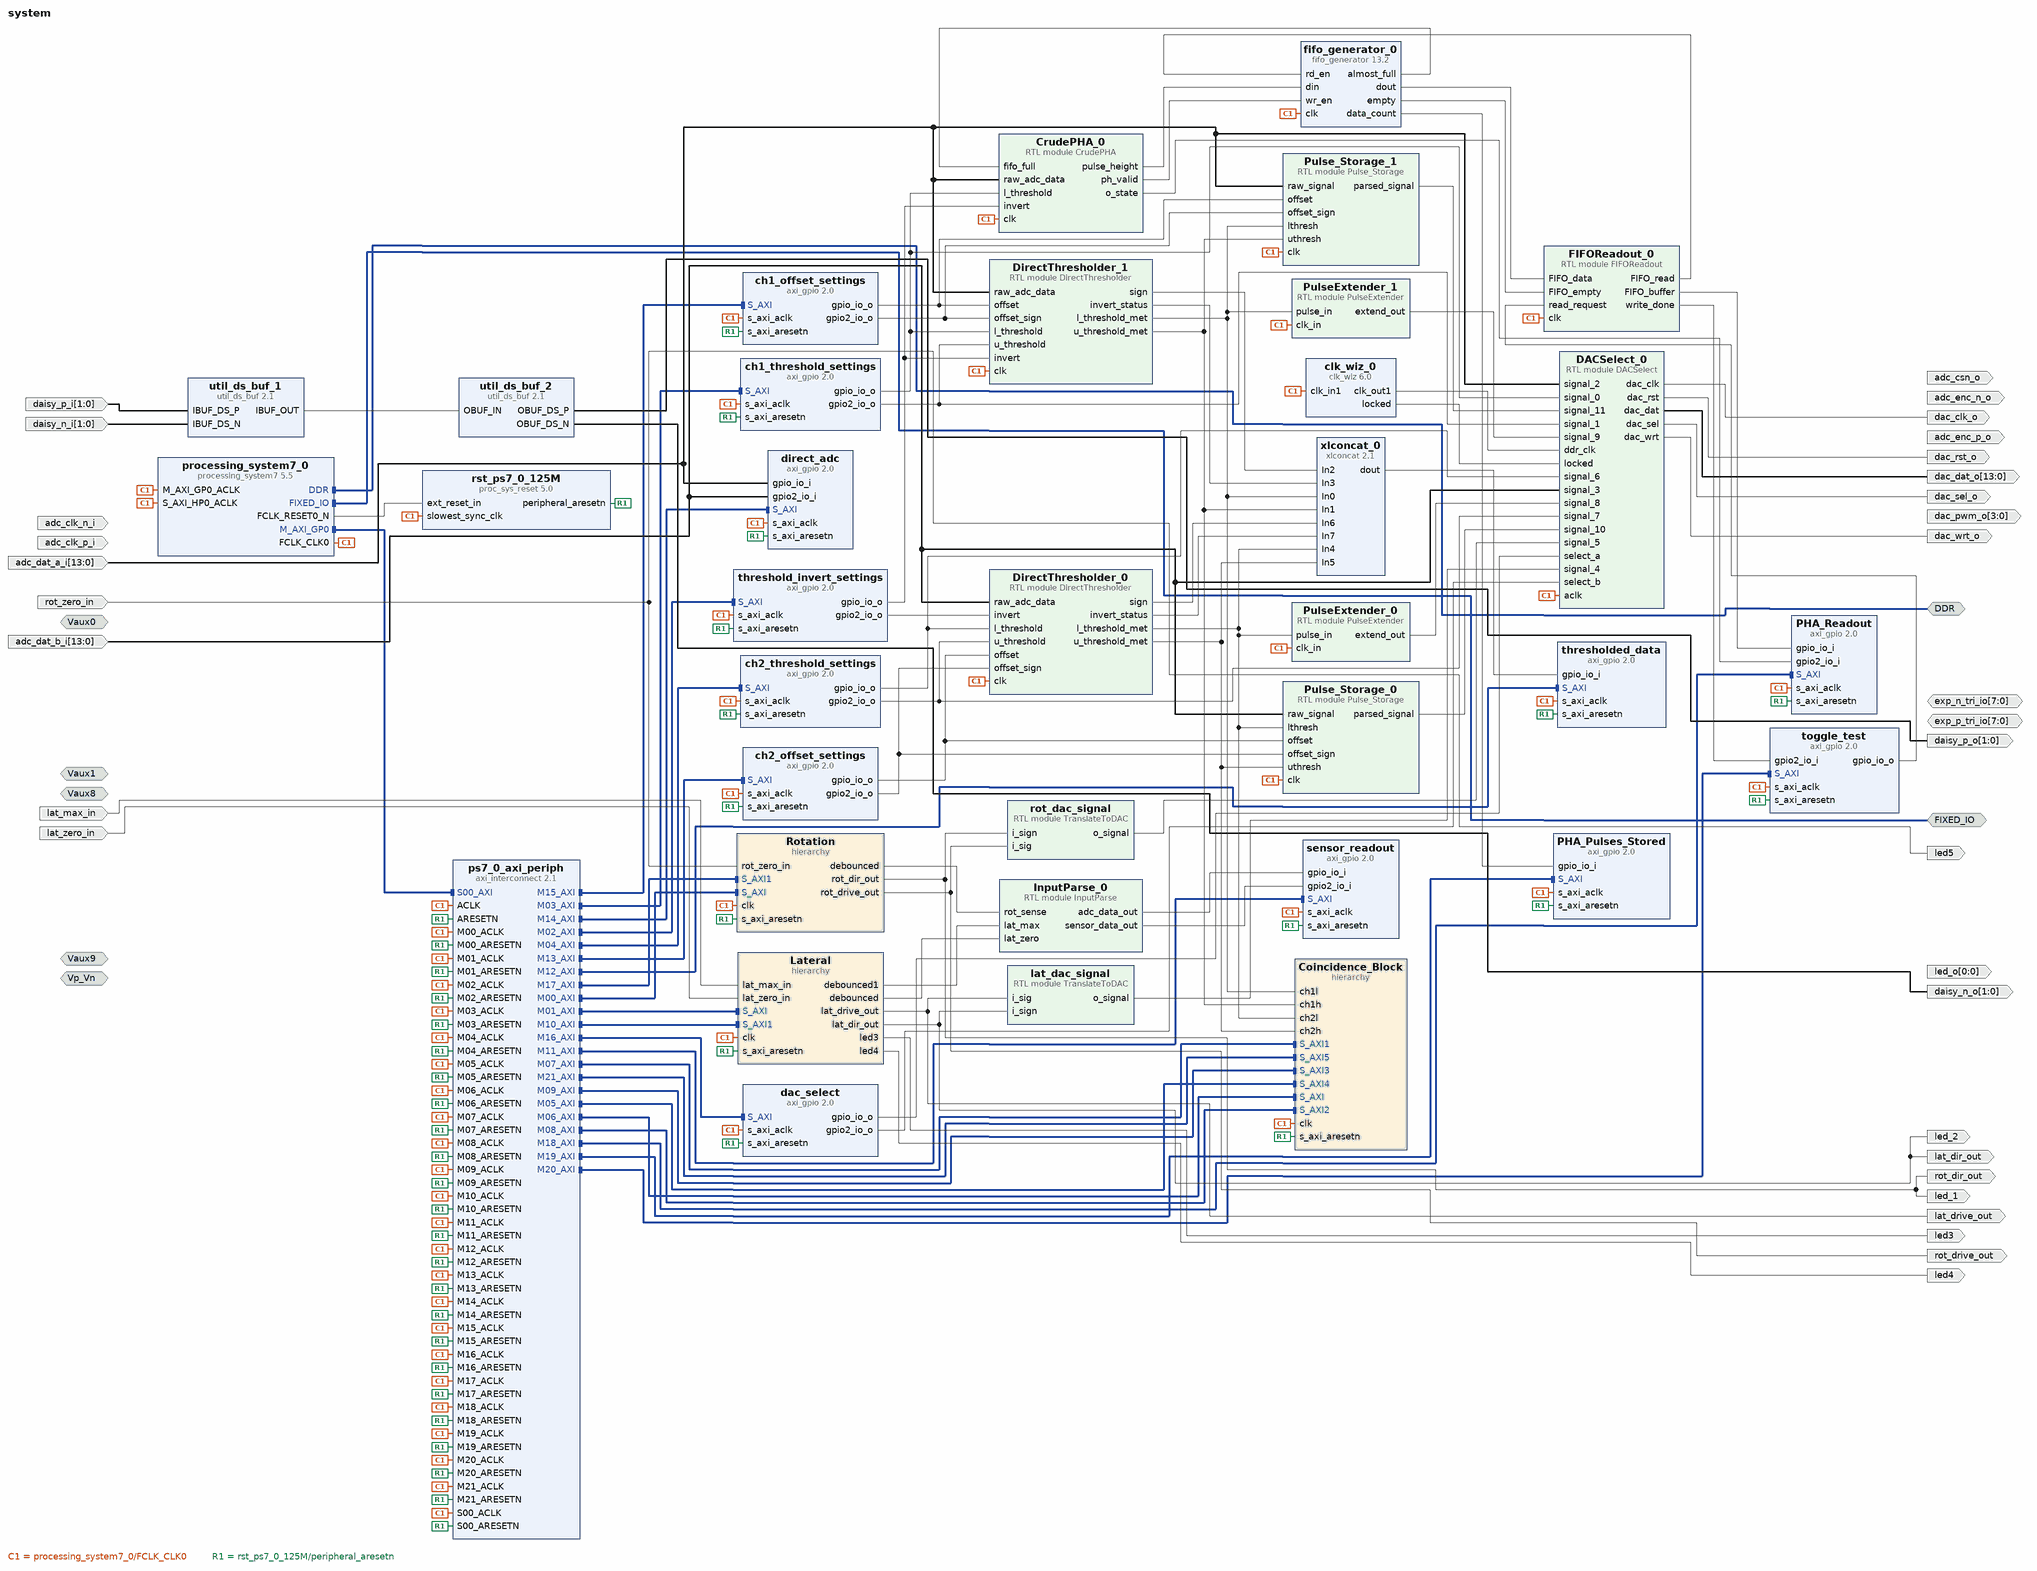
[diagram p0: block diagram of the top level]
# Vivado block design system, xc7z010clg400-1, Vivado 2020.1
create_bd_design system

create_bd_intf_port -mode Slave -vlnv xilinx.com:interface:diff_analog_io_rtl:1.0 Vp_Vn
create_bd_intf_port -mode Slave -vlnv xilinx.com:interface:diff_analog_io_rtl:1.0 Vaux0
create_bd_intf_port -mode Slave -vlnv xilinx.com:interface:diff_analog_io_rtl:1.0 Vaux1
create_bd_intf_port -mode Slave -vlnv xilinx.com:interface:diff_analog_io_rtl:1.0 Vaux9
create_bd_intf_port -mode Slave -vlnv xilinx.com:interface:diff_analog_io_rtl:1.0 Vaux8
create_bd_intf_port -mode Master -vlnv xilinx.com:interface:ddrx_rtl:1.0 DDR
create_bd_intf_port -mode Master -vlnv xilinx.com:display_processing_system7:fixedio_rtl:1.0 FIXED_IO
create_bd_port -dir I -from 13 -to 0 adc_dat_a_i
create_bd_port -dir I -from 13 -to 0 adc_dat_b_i
create_bd_port -dir I adc_clk_p_i
create_bd_port -dir I adc_clk_n_i
create_bd_port -dir O adc_enc_p_o
create_bd_port -dir O adc_enc_n_o
create_bd_port -dir O adc_csn_o
create_bd_port -dir O -from 13 -to 0 dac_dat_o
create_bd_port -dir O dac_clk_o
create_bd_port -dir O dac_rst_o
create_bd_port -dir O dac_sel_o
create_bd_port -dir O dac_wrt_o
create_bd_port -dir O -from 3 -to 0 dac_pwm_o
create_bd_port -dir IO -from 7 -to 0 exp_p_tri_io
create_bd_port -dir IO -from 7 -to 0 exp_n_tri_io
create_bd_port -dir O -from 1 -to 0 daisy_p_o
create_bd_port -dir O -from 1 -to 0 daisy_n_o
create_bd_port -dir I -from 1 -to 0 daisy_p_i
create_bd_port -dir I -from 1 -to 0 daisy_n_i
create_bd_port -dir O -from 0 -to 0 led_o
create_bd_port -dir I rot_zero_in
create_bd_port -dir I lat_zero_in
create_bd_port -dir I lat_max_in
create_bd_port -dir O rot_drive_out
create_bd_port -dir O rot_dir_out
create_bd_port -dir O lat_drive_out
create_bd_port -dir O lat_dir_out
create_bd_port -dir O led_1
create_bd_port -dir O led_2
create_bd_port -dir O led3
create_bd_port -dir O led4
create_bd_port -dir O led5

create_bd_cell -type ip -vlnv xilinx.com:ip:processing_system7:5.5 processing_system7_0
set_property -dict [list \
  CONFIG.PCW_APU_PERIPHERAL_FREQMHZ 666.666666 \
  CONFIG.PCW_ENET0_ENET0_IO {MIO 16 .. 27} \
  CONFIG.PCW_ENET0_GRP_MDIO_ENABLE 1 \
  CONFIG.PCW_ENET0_GRP_MDIO_IO EMIO \
  CONFIG.PCW_ENET0_PERIPHERAL_ENABLE 1 \
  CONFIG.PCW_ENET0_RESET_ENABLE 0 \
  CONFIG.PCW_ENET_RESET_ENABLE 1 \
  CONFIG.PCW_ENET_RESET_SELECT {Share reset pin} \
  CONFIG.PCW_FPGA0_PERIPHERAL_FREQMHZ 125 \
  CONFIG.PCW_FPGA1_PERIPHERAL_FREQMHZ 250 \
  CONFIG.PCW_FPGA3_PERIPHERAL_FREQMHZ 200 \
  CONFIG.PCW_GPIO_MIO_GPIO_ENABLE 1 \
  CONFIG.PCW_GPIO_MIO_GPIO_IO MIO \
  CONFIG.PCW_GPIO_PERIPHERAL_ENABLE 1 \
  CONFIG.PCW_I2C0_GRP_INT_ENABLE 0 \
  CONFIG.PCW_I2C0_I2C0_IO {MIO 50 .. 51} \
  CONFIG.PCW_I2C0_PERIPHERAL_ENABLE 1 \
  CONFIG.PCW_I2C_PERIPHERAL_FREQMHZ 111.111115 \
  CONFIG.PCW_I2C_RESET_ENABLE 1 \
  CONFIG.PCW_I2C_RESET_SELECT {Share reset pin} \
  CONFIG.PCW_IMPORT_BOARD_PRESET cfg/red_pitaya.xml \
  CONFIG.PCW_PRESET_BANK1_VOLTAGE {LVCMOS 2.5V} \
  CONFIG.PCW_QSPI_GRP_SINGLE_SS_ENABLE 1 \
  CONFIG.PCW_QSPI_GRP_SINGLE_SS_IO {MIO 1 .. 6} \
  CONFIG.PCW_QSPI_PERIPHERAL_ENABLE 1 \
  CONFIG.PCW_QSPI_PERIPHERAL_FREQMHZ 125 \
  CONFIG.PCW_QSPI_QSPI_IO {MIO 1 .. 6} \
  CONFIG.PCW_SD0_GRP_CD_ENABLE 1 \
  CONFIG.PCW_SD0_GRP_CD_IO {MIO 46} \
  CONFIG.PCW_SD0_GRP_WP_ENABLE 1 \
  CONFIG.PCW_SD0_GRP_WP_IO {MIO 47} \
  CONFIG.PCW_SD0_PERIPHERAL_ENABLE 1 \
  CONFIG.PCW_SD0_SD0_IO {MIO 40 .. 45} \
  CONFIG.PCW_SDIO_PERIPHERAL_FREQMHZ 100 \
  CONFIG.PCW_SINGLE_QSPI_DATA_MODE x4 \
  CONFIG.PCW_SPI0_PERIPHERAL_ENABLE 1 \
  CONFIG.PCW_SPI0_SPI0_IO EMIO \
  CONFIG.PCW_SPI1_PERIPHERAL_ENABLE 1 \
  CONFIG.PCW_SPI1_SPI1_IO {MIO 10 .. 15} \
  CONFIG.PCW_TTC0_PERIPHERAL_ENABLE 1 \
  CONFIG.PCW_TTC0_TTC0_IO EMIO \
  CONFIG.PCW_UART0_PERIPHERAL_ENABLE 1 \
  CONFIG.PCW_UART0_UART0_IO {MIO 14 .. 15} \
  CONFIG.PCW_UART1_PERIPHERAL_ENABLE 1 \
  CONFIG.PCW_UART1_UART1_IO {MIO 8 .. 9} \
  CONFIG.PCW_UART_PERIPHERAL_FREQMHZ 100 \
  CONFIG.PCW_UIPARAM_DDR_BUS_WIDTH {16 Bit} \
  CONFIG.PCW_UIPARAM_DDR_FREQ_MHZ 533.333333 \
  CONFIG.PCW_UIPARAM_DDR_PARTNO {MT41J256M16 RE-125} \
  CONFIG.PCW_USB0_PERIPHERAL_ENABLE 1 \
  CONFIG.PCW_USB0_RESET_ENABLE 1 \
  CONFIG.PCW_USB0_RESET_IO {MIO 48} \
  CONFIG.PCW_USB0_USB0_IO {MIO 28 .. 39} \
  CONFIG.PCW_USB_RESET_ENABLE 1 \
  CONFIG.PCW_USB_RESET_SELECT {Share reset pin} \
  CONFIG.PCW_USE_S_AXI_HP0 1 \
] [get_bd_cells processing_system7_0]
# 429 more settings of processing_system7_0 are not shown: defaults, MIO pin electricals, DDR timing, and values the tool derives
create_bd_cell -type ip -vlnv xilinx.com:ip:util_ds_buf:2.1 util_ds_buf_1
set_property -dict {CONFIG.C_SIZE 2} [get_bd_cells util_ds_buf_1]
create_bd_cell -type ip -vlnv xilinx.com:ip:util_ds_buf:2.1 util_ds_buf_2
set_property -dict {CONFIG.C_BUF_TYPE OBUFDS CONFIG.C_SIZE 2} [get_bd_cells util_ds_buf_2]
create_bd_cell -type ip -vlnv xilinx.com:ip:proc_sys_reset:5.0 rst_ps7_0_125M
create_bd_cell -type hier Rotation
create_bd_cell -type ip -vlnv xilinx.com:ip:axi_interconnect:2.1 ps7_0_axi_periph
set_property -dict {CONFIG.NUM_MI 22} [get_bd_cells ps7_0_axi_periph]
create_bd_cell -type hier Lateral
create_bd_cell -type ip -vlnv xilinx.com:ip:clk_wiz:6.0 clk_wiz_0
set_property -dict [list \
  CONFIG.CLKIN1_JITTER_PS 80.0 \
  CONFIG.CLKOUT1_JITTER 104.759 \
  CONFIG.CLKOUT1_PHASE_ERROR 96.948 \
  CONFIG.CLKOUT1_REQUESTED_OUT_FREQ 250 \
  CONFIG.MMCM_CLKFBOUT_MULT_F 8.000 \
  CONFIG.MMCM_CLKIN1_PERIOD 8.000 \
  CONFIG.MMCM_CLKOUT0_DIVIDE_F 4.000 \
  CONFIG.PRIM_IN_FREQ 125 \
  CONFIG.USE_RESET false \
] [get_bd_cells clk_wiz_0]
create_bd_cell -type ip -vlnv xilinx.com:ip:axi_gpio:2.0 ch1_threshold_settings
set_property -dict [list \
  CONFIG.C_ALL_OUTPUTS 1 \
  CONFIG.C_ALL_OUTPUTS_2 1 \
  CONFIG.C_DOUT_DEFAULT 0x000000FA \
  CONFIG.C_DOUT_DEFAULT_2 0x000004F4 \
  CONFIG.C_IS_DUAL 1 \
] [get_bd_cells ch1_threshold_settings]
create_bd_cell -type ip -vlnv xilinx.com:ip:axi_gpio:2.0 ch2_threshold_settings
set_property -dict [list \
  CONFIG.C_ALL_OUTPUTS 1 \
  CONFIG.C_ALL_OUTPUTS_2 1 \
  CONFIG.C_DOUT_DEFAULT 0x000000FA \
  CONFIG.C_DOUT_DEFAULT_2 0x000004F4 \
  CONFIG.C_IS_DUAL 1 \
] [get_bd_cells ch2_threshold_settings]
create_bd_cell -type ip -vlnv xilinx.com:ip:axi_gpio:2.0 threshold_invert_settings
set_property -dict [list \
  CONFIG.C_ALL_OUTPUTS 1 \
  CONFIG.C_ALL_OUTPUTS_2 1 \
  CONFIG.C_DOUT_DEFAULT 0x00000000 \
  CONFIG.C_DOUT_DEFAULT_2 0x00000000 \
  CONFIG.C_GPIO2_WIDTH 1 \
  CONFIG.C_GPIO_WIDTH 1 \
  CONFIG.C_IS_DUAL 1 \
] [get_bd_cells threshold_invert_settings]
create_bd_cell -type ip -vlnv xilinx.com:ip:axi_gpio:2.0 sensor_readout
set_property -dict {CONFIG.C_ALL_INPUTS 1 CONFIG.C_ALL_INPUTS_2 1 CONFIG.C_IS_DUAL 1} [get_bd_cells sensor_readout]
create_bd_cell -type ip -vlnv xilinx.com:ip:xlconcat:2.1 xlconcat_0
set_property -dict {CONFIG.NUM_PORTS 8} [get_bd_cells xlconcat_0]
create_bd_cell -type ip -vlnv xilinx.com:ip:axi_gpio:2.0 thresholded_data
create_bd_cell -type module -reference InputParse InputParse_0
create_bd_cell -type ip -vlnv xilinx.com:ip:axi_gpio:2.0 direct_adc
set_property -dict {CONFIG.C_IS_DUAL 1} [get_bd_cells direct_adc]
create_bd_cell -type ip -vlnv xilinx.com:ip:axi_gpio:2.0 ch1_offset_settings
set_property -dict {CONFIG.C_IS_DUAL 1} [get_bd_cells ch1_offset_settings]
create_bd_cell -type ip -vlnv xilinx.com:ip:axi_gpio:2.0 ch2_offset_settings
set_property -dict {CONFIG.C_IS_DUAL 1} [get_bd_cells ch2_offset_settings]
create_bd_cell -type hier Coincidence_Block
create_bd_cell -type ip -vlnv xilinx.com:ip:axi_gpio:2.0 dac_select
set_property -dict [list \
  CONFIG.C_ALL_OUTPUTS 1 \
  CONFIG.C_ALL_OUTPUTS_2 1 \
  CONFIG.C_DOUT_DEFAULT_2 0x00000002 \
  CONFIG.C_GPIO2_WIDTH 8 \
  CONFIG.C_GPIO_WIDTH 8 \
  CONFIG.C_IS_DUAL 1 \
] [get_bd_cells dac_select]
create_bd_cell -type module -reference TranslateToDAC lat_dac_signal
create_bd_cell -type module -reference TranslateToDAC rot_dac_signal
create_bd_cell -type ip -vlnv xilinx.com:ip:fifo_generator:13.2 fifo_generator_0
set_property -dict [list \
  CONFIG.Almost_Full_Flag true \
  CONFIG.Data_Count true \
  CONFIG.Input_Data_Width 32 \
  CONFIG.Output_Data_Width 32 \
  CONFIG.Valid_Flag false \
] [get_bd_cells fifo_generator_0]
create_bd_cell -type ip -vlnv xilinx.com:ip:axi_gpio:2.0 PHA_Readout
set_property -dict {CONFIG.C_ALL_INPUTS 1 CONFIG.C_ALL_INPUTS_2 1 CONFIG.C_IS_DUAL 1} [get_bd_cells PHA_Readout]
create_bd_cell -type ip -vlnv xilinx.com:ip:axi_gpio:2.0 PHA_Pulses_Stored
set_property -dict {CONFIG.C_ALL_INPUTS 1 CONFIG.C_IS_DUAL 0} [get_bd_cells PHA_Pulses_Stored]
create_bd_cell -type ip -vlnv xilinx.com:ip:axi_gpio:2.0 toggle_test
set_property -dict {CONFIG.C_ALL_INPUTS_2 1 CONFIG.C_ALL_OUTPUTS 1 CONFIG.C_IS_DUAL 1} [get_bd_cells toggle_test]
create_bd_cell -type module -reference FIFOReadout FIFOReadout_0
create_bd_cell -type module -reference CrudePHA CrudePHA_0
create_bd_cell -type module -reference PulseExtender PulseExtender_0
create_bd_cell -type module -reference PulseExtender PulseExtender_1
create_bd_cell -type module -reference DACSelect DACSelect_0
create_bd_cell -type module -reference DirectThresholder DirectThresholder_0
create_bd_cell -type module -reference DirectThresholder DirectThresholder_1
create_bd_cell -type module -reference Pulse_Storage Pulse_Storage_0
create_bd_cell -type module -reference Pulse_Storage Pulse_Storage_1

# ---- hierarchy /Rotation ----
current_bd_instance /Rotation
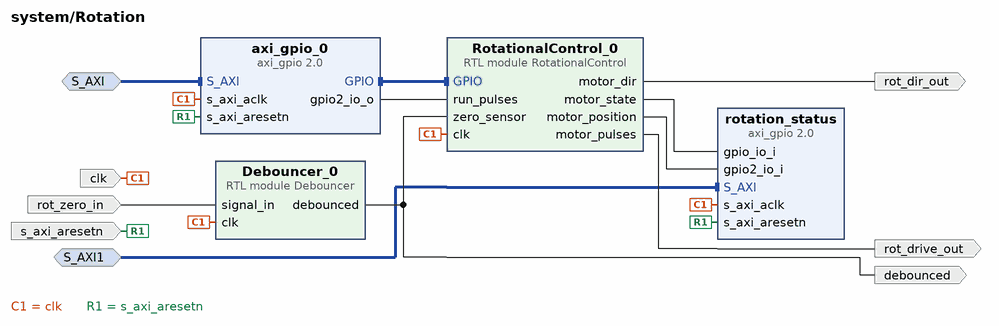
[diagram p1: block diagram inside /Rotation]
create_bd_intf_pin -mode Slave -vlnv xilinx.com:interface:aximm_rtl:1.0 S_AXI
create_bd_intf_pin -mode Slave -vlnv xilinx.com:interface:aximm_rtl:1.0 S_AXI1
create_bd_pin -dir I -type clk clk
create_bd_pin -dir I -type rst s_axi_aresetn
create_bd_pin -dir I rot_zero_in
create_bd_pin -dir O rot_dir_out
create_bd_pin -dir O rot_drive_out
create_bd_pin -dir O debounced

create_bd_cell -type ip -vlnv xilinx.com:ip:axi_gpio:2.0 axi_gpio_0
set_property -dict {CONFIG.C_ALL_OUTPUTS 1 CONFIG.C_ALL_OUTPUTS_2 1 CONFIG.C_IS_DUAL 1} [get_bd_cells axi_gpio_0]
create_bd_cell -type module -reference Debouncer Debouncer_0
create_bd_cell -type ip -vlnv xilinx.com:ip:axi_gpio:2.0 rotation_status
set_property -dict {CONFIG.C_IS_DUAL 1} [get_bd_cells rotation_status]
create_bd_cell -type module -reference RotationalControl RotationalControl_0

# ---- hierarchy /Lateral ----
current_bd_instance /Lateral
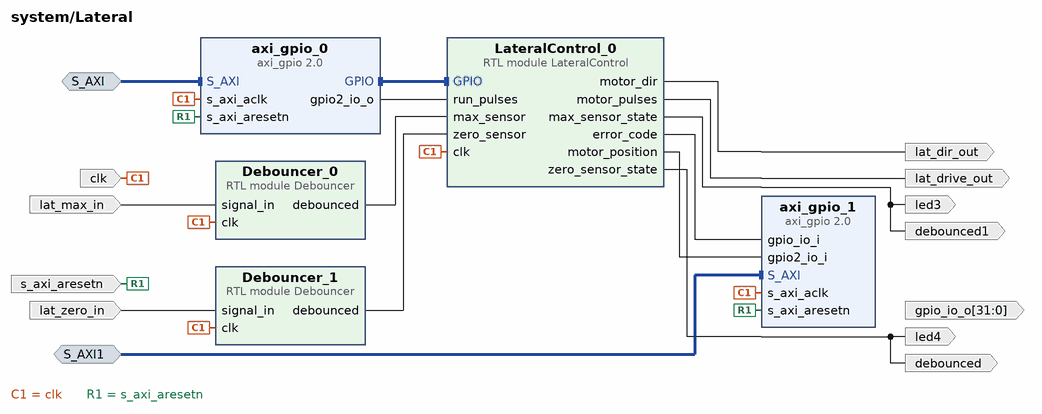
[diagram p2: block diagram inside /Lateral]
create_bd_intf_pin -mode Slave -vlnv xilinx.com:interface:aximm_rtl:1.0 S_AXI
create_bd_intf_pin -mode Slave -vlnv xilinx.com:interface:aximm_rtl:1.0 S_AXI1
create_bd_pin -dir I lat_max_in
create_bd_pin -dir I lat_zero_in
create_bd_pin -dir I -type clk clk
create_bd_pin -dir O lat_drive_out
create_bd_pin -dir O lat_dir_out
create_bd_pin -dir I -type rst s_axi_aresetn
create_bd_pin -dir O debounced
create_bd_pin -dir O debounced1
create_bd_pin -dir O -from 31 -to 0 gpio_io_o
create_bd_pin -dir O led3
create_bd_pin -dir O led4

create_bd_cell -type ip -vlnv xilinx.com:ip:axi_gpio:2.0 axi_gpio_0
set_property -dict {CONFIG.C_ALL_OUTPUTS 1 CONFIG.C_ALL_OUTPUTS_2 1 CONFIG.C_IS_DUAL 1} [get_bd_cells axi_gpio_0]
create_bd_cell -type ip -vlnv xilinx.com:ip:axi_gpio:2.0 axi_gpio_1
set_property -dict {CONFIG.C_IS_DUAL 1} [get_bd_cells axi_gpio_1]
create_bd_cell -type module -reference Debouncer Debouncer_0
create_bd_cell -type module -reference Debouncer Debouncer_1
set_property -dict {CONFIG.inverted 0} [get_bd_cells Debouncer_1]
create_bd_cell -type module -reference LateralControl LateralControl_0
set_property -dict {CONFIG.pulse_off 25000 CONFIG.reset_timeout 100000} [get_bd_cells LateralControl_0]

# ---- hierarchy /Coincidence_Block ----
current_bd_instance /Coincidence_Block
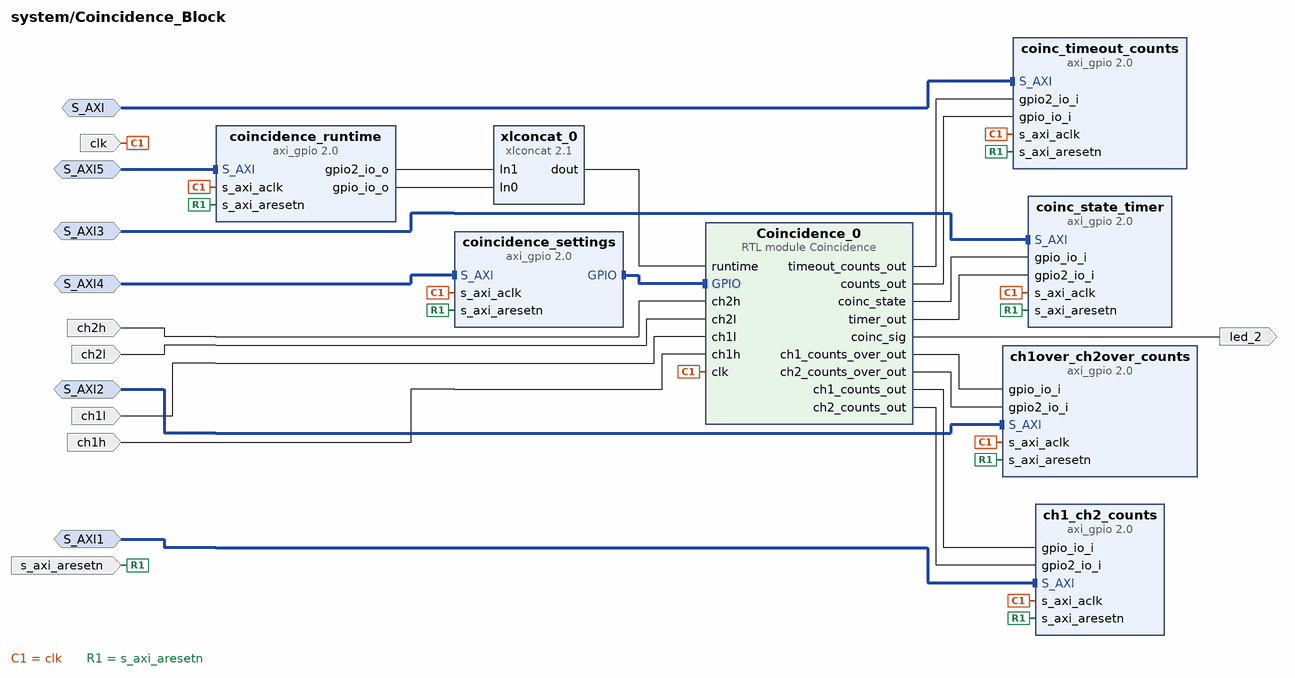
[diagram p3: block diagram inside /Coincidence_Block]
create_bd_intf_pin -mode Slave -vlnv xilinx.com:interface:aximm_rtl:1.0 S_AXI
create_bd_intf_pin -mode Slave -vlnv xilinx.com:interface:aximm_rtl:1.0 S_AXI1
create_bd_intf_pin -mode Slave -vlnv xilinx.com:interface:aximm_rtl:1.0 S_AXI2
create_bd_intf_pin -mode Slave -vlnv xilinx.com:interface:aximm_rtl:1.0 S_AXI3
create_bd_intf_pin -mode Slave -vlnv xilinx.com:interface:aximm_rtl:1.0 S_AXI4
create_bd_intf_pin -mode Slave -vlnv xilinx.com:interface:aximm_rtl:1.0 S_AXI5
create_bd_pin -dir I -type clk clk
create_bd_pin -dir I ch2h
create_bd_pin -dir I ch2l
create_bd_pin -dir I -type rst s_axi_aresetn
create_bd_pin -dir I ch1l
create_bd_pin -dir I ch1h
create_bd_pin -dir O led_2

create_bd_cell -type ip -vlnv xilinx.com:ip:axi_gpio:2.0 coinc_timeout_counts
set_property -dict {CONFIG.C_IS_DUAL 1} [get_bd_cells coinc_timeout_counts]
create_bd_cell -type ip -vlnv xilinx.com:ip:axi_gpio:2.0 ch1_ch2_counts
set_property -dict {CONFIG.C_ALL_INPUTS 1 CONFIG.C_ALL_INPUTS_2 1 CONFIG.C_IS_DUAL 1} [get_bd_cells ch1_ch2_counts]
create_bd_cell -type ip -vlnv xilinx.com:ip:axi_gpio:2.0 ch1over_ch2over_counts
set_property -dict {CONFIG.C_ALL_INPUTS 1 CONFIG.C_ALL_INPUTS_2 1 CONFIG.C_IS_DUAL 1} [get_bd_cells ch1over_ch2over_counts]
create_bd_cell -type ip -vlnv xilinx.com:ip:axi_gpio:2.0 coinc_state_timer
set_property -dict {CONFIG.C_ALL_INPUTS 1 CONFIG.C_ALL_INPUTS_2 1 CONFIG.C_IS_DUAL 1} [get_bd_cells coinc_state_timer]
create_bd_cell -type ip -vlnv xilinx.com:ip:axi_gpio:2.0 coincidence_settings
set_property -dict [list \
  CONFIG.C_DOUT_DEFAULT 0x00000002 \
  CONFIG.C_IS_DUAL 0 \
  CONFIG.C_TRI_DEFAULT 0xFFFF0000 \
] [get_bd_cells coincidence_settings]
create_bd_cell -type ip -vlnv xilinx.com:ip:xlconcat:2.1 xlconcat_0
set_property -dict {CONFIG.IN0_WIDTH 32 CONFIG.IN1_WIDTH 32} [get_bd_cells xlconcat_0]
create_bd_cell -type ip -vlnv xilinx.com:ip:axi_gpio:2.0 coincidence_runtime
set_property -dict {CONFIG.C_ALL_OUTPUTS 1 CONFIG.C_ALL_OUTPUTS_2 1 CONFIG.C_IS_DUAL 1} [get_bd_cells coincidence_runtime]
create_bd_cell -type module -reference Coincidence Coincidence_0

# ---- connections ----

current_bd_instance /Rotation
connect_bd_intf_net [get_bd_intf_pins S_AXI1] [get_bd_intf_pins rotation_status/S_AXI]
connect_bd_intf_net [get_bd_intf_pins RotationalControl_0/GPIO] [get_bd_intf_pins axi_gpio_0/GPIO]
connect_bd_intf_net [get_bd_intf_pins S_AXI] [get_bd_intf_pins axi_gpio_0/S_AXI]
connect_bd_net [get_bd_pins Debouncer_0/debounced] [get_bd_pins debounced] [get_bd_pins RotationalControl_0/zero_sensor]
connect_bd_net [get_bd_pins clk] \
  [get_bd_pins axi_gpio_0/s_axi_aclk] [get_bd_pins Debouncer_0/clk] [get_bd_pins rotation_status/s_axi_aclk] \
  [get_bd_pins RotationalControl_0/clk]
connect_bd_net [get_bd_pins s_axi_aresetn] [get_bd_pins axi_gpio_0/s_axi_aresetn] [get_bd_pins rotation_status/s_axi_aresetn]
connect_bd_net [get_bd_pins rot_zero_in] [get_bd_pins Debouncer_0/signal_in]
connect_bd_net [get_bd_pins RotationalControl_0/motor_dir] [get_bd_pins rot_dir_out]
connect_bd_net [get_bd_pins RotationalControl_0/motor_pulses] [get_bd_pins rot_drive_out]
connect_bd_net [get_bd_pins axi_gpio_0/gpio2_io_o] [get_bd_pins RotationalControl_0/run_pulses]
connect_bd_net [get_bd_pins RotationalControl_0/motor_state] [get_bd_pins rotation_status/gpio_io_i]
connect_bd_net [get_bd_pins RotationalControl_0/motor_position] [get_bd_pins rotation_status/gpio2_io_i]

current_bd_instance /Lateral
connect_bd_intf_net [get_bd_intf_pins S_AXI1] [get_bd_intf_pins axi_gpio_1/S_AXI]
connect_bd_intf_net [get_bd_intf_pins S_AXI] [get_bd_intf_pins axi_gpio_0/S_AXI]
connect_bd_intf_net [get_bd_intf_pins axi_gpio_0/GPIO] [get_bd_intf_pins LateralControl_0/GPIO]
connect_bd_net [get_bd_pins lat_max_in] [get_bd_pins Debouncer_0/signal_in]
connect_bd_net [get_bd_pins lat_zero_in] [get_bd_pins Debouncer_1/signal_in]
connect_bd_net [get_bd_pins clk] \
  [get_bd_pins axi_gpio_0/s_axi_aclk] [get_bd_pins axi_gpio_1/s_axi_aclk] [get_bd_pins Debouncer_0/clk] \
  [get_bd_pins Debouncer_1/clk] [get_bd_pins LateralControl_0/clk]
connect_bd_net [get_bd_pins Debouncer_0/debounced] [get_bd_pins LateralControl_0/max_sensor]
connect_bd_net [get_bd_pins Debouncer_1/debounced] [get_bd_pins LateralControl_0/zero_sensor]
connect_bd_net [get_bd_pins LateralControl_0/motor_pulses] [get_bd_pins lat_drive_out]
connect_bd_net [get_bd_pins LateralControl_0/motor_dir] [get_bd_pins lat_dir_out]
connect_bd_net [get_bd_pins s_axi_aresetn] [get_bd_pins axi_gpio_0/s_axi_aresetn] [get_bd_pins axi_gpio_1/s_axi_aresetn]
connect_bd_net [get_bd_pins axi_gpio_0/gpio2_io_o] [get_bd_pins LateralControl_0/run_pulses]
connect_bd_net [get_bd_pins LateralControl_0/error_code] [get_bd_pins axi_gpio_1/gpio_io_i]
connect_bd_net [get_bd_pins LateralControl_0/motor_position] [get_bd_pins axi_gpio_1/gpio2_io_i]
connect_bd_net [get_bd_pins LateralControl_0/max_sensor_state] [get_bd_pins led3] [get_bd_pins debounced1]
connect_bd_net [get_bd_pins LateralControl_0/zero_sensor_state] [get_bd_pins led4] [get_bd_pins debounced]

current_bd_instance /Coincidence_Block
connect_bd_intf_net [get_bd_intf_pins S_AXI2] [get_bd_intf_pins ch1over_ch2over_counts/S_AXI]
connect_bd_intf_net [get_bd_intf_pins S_AXI] [get_bd_intf_pins coinc_timeout_counts/S_AXI]
connect_bd_intf_net [get_bd_intf_pins S_AXI1] [get_bd_intf_pins ch1_ch2_counts/S_AXI]
connect_bd_intf_net [get_bd_intf_pins S_AXI5] [get_bd_intf_pins coincidence_runtime/S_AXI]
connect_bd_intf_net [get_bd_intf_pins S_AXI3] [get_bd_intf_pins coinc_state_timer/S_AXI]
connect_bd_intf_net [get_bd_intf_pins Coincidence_0/GPIO] [get_bd_intf_pins coincidence_settings/GPIO]
connect_bd_intf_net [get_bd_intf_pins S_AXI4] [get_bd_intf_pins coincidence_settings/S_AXI]
connect_bd_net [get_bd_pins clk] \
  [get_bd_pins coinc_timeout_counts/s_axi_aclk] [get_bd_pins ch1_ch2_counts/s_axi_aclk] \
  [get_bd_pins ch1over_ch2over_counts/s_axi_aclk] [get_bd_pins coinc_state_timer/s_axi_aclk] \
  [get_bd_pins coincidence_settings/s_axi_aclk] [get_bd_pins coincidence_runtime/s_axi_aclk] [get_bd_pins Coincidence_0/clk]
connect_bd_net [get_bd_pins ch2h] [get_bd_pins Coincidence_0/ch2h]
connect_bd_net [get_bd_pins ch2l] [get_bd_pins Coincidence_0/ch2l]
connect_bd_net [get_bd_pins s_axi_aresetn] \
  [get_bd_pins coinc_timeout_counts/s_axi_aresetn] [get_bd_pins ch1_ch2_counts/s_axi_aresetn] \
  [get_bd_pins ch1over_ch2over_counts/s_axi_aresetn] [get_bd_pins coinc_state_timer/s_axi_aresetn] \
  [get_bd_pins coincidence_settings/s_axi_aresetn] [get_bd_pins coincidence_runtime/s_axi_aresetn]
connect_bd_net [get_bd_pins Coincidence_0/timeout_counts_out] [get_bd_pins coinc_timeout_counts/gpio2_io_i]
connect_bd_net [get_bd_pins Coincidence_0/counts_out] [get_bd_pins coinc_timeout_counts/gpio_io_i]
connect_bd_net [get_bd_pins Coincidence_0/ch1_counts_out] [get_bd_pins ch1_ch2_counts/gpio_io_i]
connect_bd_net [get_bd_pins Coincidence_0/ch2_counts_out] [get_bd_pins ch1_ch2_counts/gpio2_io_i]
connect_bd_net [get_bd_pins Coincidence_0/ch1_counts_over_out] [get_bd_pins ch1over_ch2over_counts/gpio_io_i]
connect_bd_net [get_bd_pins Coincidence_0/ch2_counts_over_out] [get_bd_pins ch1over_ch2over_counts/gpio2_io_i]
connect_bd_net [get_bd_pins Coincidence_0/coinc_state] [get_bd_pins coinc_state_timer/gpio_io_i]
connect_bd_net [get_bd_pins Coincidence_0/timer_out] [get_bd_pins coinc_state_timer/gpio2_io_i]
connect_bd_net [get_bd_pins ch1l] [get_bd_pins Coincidence_0/ch1l]
connect_bd_net [get_bd_pins ch1h] [get_bd_pins Coincidence_0/ch1h]
connect_bd_net [get_bd_pins Coincidence_0/coinc_sig] [get_bd_pins led_2]
connect_bd_net [get_bd_pins xlconcat_0/dout] [get_bd_pins Coincidence_0/runtime]
connect_bd_net [get_bd_pins coincidence_runtime/gpio2_io_o] [get_bd_pins xlconcat_0/In1]
connect_bd_net [get_bd_pins coincidence_runtime/gpio_io_o] [get_bd_pins xlconcat_0/In0]

current_bd_instance /
connect_bd_intf_net [get_bd_intf_pins ps7_0_axi_periph/M11_AXI] [get_bd_intf_pins sensor_readout/S_AXI]
connect_bd_intf_net [get_bd_intf_pins ps7_0_axi_periph/M17_AXI] [get_bd_intf_pins Rotation/S_AXI1]
connect_bd_intf_net [get_bd_intf_pins ps7_0_axi_periph/M01_AXI] [get_bd_intf_pins Lateral/S_AXI]
connect_bd_intf_net [get_bd_intf_pins ps7_0_axi_periph/M13_AXI] [get_bd_intf_pins ch2_offset_settings/S_AXI]
connect_bd_intf_net [get_bd_intf_pins ps7_0_axi_periph/M15_AXI] [get_bd_intf_pins ch1_offset_settings/S_AXI]
connect_bd_intf_net [get_bd_intf_pins processing_system7_0/M_AXI_GP0] [get_bd_intf_pins ps7_0_axi_periph/S00_AXI]
connect_bd_intf_net [get_bd_intf_pins ps7_0_axi_periph/M18_AXI] [get_bd_intf_pins PHA_Readout/S_AXI]
connect_bd_intf_net [get_bd_intf_pins ps7_0_axi_periph/M00_AXI] [get_bd_intf_pins Rotation/S_AXI]
connect_bd_intf_net [get_bd_intf_pins ps7_0_axi_periph/M07_AXI] [get_bd_intf_pins Coincidence_Block/S_AXI1]
connect_bd_intf_net [get_bd_intf_pins ps7_0_axi_periph/M21_AXI] [get_bd_intf_pins Coincidence_Block/S_AXI5]
connect_bd_intf_net [get_bd_intf_pins ps7_0_axi_periph/M20_AXI] [get_bd_intf_pins toggle_test/S_AXI]
connect_bd_intf_net [get_bd_intf_pins ps7_0_axi_periph/M04_AXI] [get_bd_intf_pins ch2_threshold_settings/S_AXI]
connect_bd_intf_net [get_bd_intf_ports DDR] [get_bd_intf_pins processing_system7_0/DDR]
connect_bd_intf_net [get_bd_intf_pins ps7_0_axi_periph/M03_AXI] [get_bd_intf_pins ch1_threshold_settings/S_AXI]
connect_bd_intf_net [get_bd_intf_pins ps7_0_axi_periph/M19_AXI] [get_bd_intf_pins PHA_Pulses_Stored/S_AXI]
connect_bd_intf_net [get_bd_intf_pins ps7_0_axi_periph/M16_AXI] [get_bd_intf_pins dac_select/S_AXI]
connect_bd_intf_net [get_bd_intf_pins ps7_0_axi_periph/M09_AXI] [get_bd_intf_pins Coincidence_Block/S_AXI3]
connect_bd_intf_net [get_bd_intf_pins ps7_0_axi_periph/M10_AXI] [get_bd_intf_pins Lateral/S_AXI1]
connect_bd_intf_net [get_bd_intf_ports FIXED_IO] [get_bd_intf_pins processing_system7_0/FIXED_IO]
connect_bd_intf_net [get_bd_intf_pins ps7_0_axi_periph/M14_AXI] [get_bd_intf_pins direct_adc/S_AXI]
connect_bd_intf_net [get_bd_intf_pins ps7_0_axi_periph/M05_AXI] [get_bd_intf_pins Coincidence_Block/S_AXI4]
connect_bd_intf_net [get_bd_intf_pins ps7_0_axi_periph/M12_AXI] [get_bd_intf_pins thresholded_data/S_AXI]
connect_bd_intf_net [get_bd_intf_pins ps7_0_axi_periph/M02_AXI] [get_bd_intf_pins threshold_invert_settings/S_AXI]
connect_bd_intf_net [get_bd_intf_pins ps7_0_axi_periph/M06_AXI] [get_bd_intf_pins Coincidence_Block/S_AXI]
connect_bd_intf_net [get_bd_intf_pins ps7_0_axi_periph/M08_AXI] [get_bd_intf_pins Coincidence_Block/S_AXI2]
connect_bd_net [get_bd_ports daisy_p_i] [get_bd_pins util_ds_buf_1/IBUF_DS_P]
connect_bd_net [get_bd_ports daisy_n_i] [get_bd_pins util_ds_buf_1/IBUF_DS_N]
connect_bd_net [get_bd_pins util_ds_buf_2/OBUF_DS_P] [get_bd_ports daisy_p_o]
connect_bd_net [get_bd_pins util_ds_buf_2/OBUF_DS_N] [get_bd_ports daisy_n_o]
connect_bd_net [get_bd_pins util_ds_buf_1/IBUF_OUT] [get_bd_pins util_ds_buf_2/OBUF_IN]
connect_bd_net [get_bd_pins processing_system7_0/FCLK_CLK0] \
  [get_bd_pins processing_system7_0/M_AXI_GP0_ACLK] [get_bd_pins processing_system7_0/S_AXI_HP0_ACLK] \
  [get_bd_pins rst_ps7_0_125M/slowest_sync_clk] [get_bd_pins Rotation/clk] [get_bd_pins ps7_0_axi_periph/ACLK] \
  [get_bd_pins ps7_0_axi_periph/S00_ACLK] [get_bd_pins ps7_0_axi_periph/M00_ACLK] [get_bd_pins Lateral/clk] \
  [get_bd_pins ps7_0_axi_periph/M01_ACLK] [get_bd_pins clk_wiz_0/clk_in1] [get_bd_pins threshold_invert_settings/s_axi_aclk] \
  [get_bd_pins ps7_0_axi_periph/M02_ACLK] [get_bd_pins ch1_threshold_settings/s_axi_aclk] \
  [get_bd_pins ps7_0_axi_periph/M03_ACLK] [get_bd_pins ch2_threshold_settings/s_axi_aclk] \
  [get_bd_pins ps7_0_axi_periph/M04_ACLK] [get_bd_pins ps7_0_axi_periph/M05_ACLK] [get_bd_pins ps7_0_axi_periph/M06_ACLK] \
  [get_bd_pins ps7_0_axi_periph/M07_ACLK] [get_bd_pins ps7_0_axi_periph/M08_ACLK] [get_bd_pins ps7_0_axi_periph/M09_ACLK] \
  [get_bd_pins ps7_0_axi_periph/M10_ACLK] [get_bd_pins sensor_readout/s_axi_aclk] [get_bd_pins ps7_0_axi_periph/M11_ACLK] \
  [get_bd_pins thresholded_data/s_axi_aclk] [get_bd_pins ps7_0_axi_periph/M12_ACLK] [get_bd_pins ps7_0_axi_periph/M13_ACLK] \
  [get_bd_pins direct_adc/s_axi_aclk] [get_bd_pins ps7_0_axi_periph/M14_ACLK] [get_bd_pins ch1_offset_settings/s_axi_aclk] \
  [get_bd_pins ps7_0_axi_periph/M15_ACLK] [get_bd_pins ch2_offset_settings/s_axi_aclk] [get_bd_pins Coincidence_Block/clk] \
  [get_bd_pins dac_select/s_axi_aclk] [get_bd_pins ps7_0_axi_periph/M16_ACLK] [get_bd_pins ps7_0_axi_periph/M17_ACLK] \
  [get_bd_pins PHA_Readout/s_axi_aclk] [get_bd_pins ps7_0_axi_periph/M18_ACLK] [get_bd_pins PHA_Pulses_Stored/s_axi_aclk] \
  [get_bd_pins ps7_0_axi_periph/M19_ACLK] [get_bd_pins fifo_generator_0/clk] [get_bd_pins toggle_test/s_axi_aclk] \
  [get_bd_pins ps7_0_axi_periph/M20_ACLK] [get_bd_pins FIFOReadout_0/clk] [get_bd_pins CrudePHA_0/clk] \
  [get_bd_pins PulseExtender_0/clk_in] [get_bd_pins PulseExtender_1/clk_in] [get_bd_pins ps7_0_axi_periph/M21_ACLK] \
  [get_bd_pins DACSelect_0/aclk] [get_bd_pins DirectThresholder_0/clk] [get_bd_pins DirectThresholder_1/clk] \
  [get_bd_pins Pulse_Storage_0/clk] [get_bd_pins Pulse_Storage_1/clk]
connect_bd_net [get_bd_pins processing_system7_0/FCLK_RESET0_N] [get_bd_pins rst_ps7_0_125M/ext_reset_in]
connect_bd_net [get_bd_pins rst_ps7_0_125M/peripheral_aresetn] \
  [get_bd_pins ps7_0_axi_periph/S00_ARESETN] [get_bd_pins Rotation/s_axi_aresetn] [get_bd_pins ps7_0_axi_periph/M00_ARESETN] \
  [get_bd_pins ps7_0_axi_periph/ARESETN] [get_bd_pins Lateral/s_axi_aresetn] [get_bd_pins ps7_0_axi_periph/M01_ARESETN] \
  [get_bd_pins threshold_invert_settings/s_axi_aresetn] [get_bd_pins ps7_0_axi_periph/M02_ARESETN] \
  [get_bd_pins ch1_threshold_settings/s_axi_aresetn] [get_bd_pins ps7_0_axi_periph/M03_ARESETN] \
  [get_bd_pins ch2_threshold_settings/s_axi_aresetn] [get_bd_pins ps7_0_axi_periph/M04_ARESETN] \
  [get_bd_pins ps7_0_axi_periph/M05_ARESETN] [get_bd_pins ps7_0_axi_periph/M06_ARESETN] \
  [get_bd_pins ps7_0_axi_periph/M07_ARESETN] [get_bd_pins ps7_0_axi_periph/M08_ARESETN] \
  [get_bd_pins ps7_0_axi_periph/M09_ARESETN] [get_bd_pins ps7_0_axi_periph/M10_ARESETN] \
  [get_bd_pins sensor_readout/s_axi_aresetn] [get_bd_pins ps7_0_axi_periph/M11_ARESETN] \
  [get_bd_pins thresholded_data/s_axi_aresetn] [get_bd_pins ps7_0_axi_periph/M12_ARESETN] \
  [get_bd_pins ps7_0_axi_periph/M13_ARESETN] [get_bd_pins direct_adc/s_axi_aresetn] \
  [get_bd_pins ps7_0_axi_periph/M14_ARESETN] [get_bd_pins ch1_offset_settings/s_axi_aresetn] \
  [get_bd_pins ps7_0_axi_periph/M15_ARESETN] [get_bd_pins ch2_offset_settings/s_axi_aresetn] \
  [get_bd_pins Coincidence_Block/s_axi_aresetn] [get_bd_pins dac_select/s_axi_aresetn] \
  [get_bd_pins ps7_0_axi_periph/M16_ARESETN] [get_bd_pins ps7_0_axi_periph/M17_ARESETN] \
  [get_bd_pins PHA_Readout/s_axi_aresetn] [get_bd_pins ps7_0_axi_periph/M18_ARESETN] \
  [get_bd_pins PHA_Pulses_Stored/s_axi_aresetn] [get_bd_pins ps7_0_axi_periph/M19_ARESETN] \
  [get_bd_pins toggle_test/s_axi_aresetn] [get_bd_pins ps7_0_axi_periph/M20_ARESETN] \
  [get_bd_pins ps7_0_axi_periph/M21_ARESETN]
connect_bd_net [get_bd_ports rot_zero_in] [get_bd_pins Rotation/rot_zero_in] [get_bd_ports led5]
connect_bd_net [get_bd_ports lat_max_in] [get_bd_pins Lateral/lat_max_in]
connect_bd_net [get_bd_ports lat_zero_in] [get_bd_pins Lateral/lat_zero_in]
connect_bd_net [get_bd_pins Rotation/rot_dir_out] [get_bd_ports rot_dir_out] [get_bd_pins rot_dac_signal/i_sign] [get_bd_ports led_1]
connect_bd_net [get_bd_pins Rotation/rot_drive_out] [get_bd_ports rot_drive_out] [get_bd_pins rot_dac_signal/i_sig]
connect_bd_net [get_bd_pins Lateral/lat_drive_out] [get_bd_ports lat_drive_out] [get_bd_pins lat_dac_signal/i_sig]
connect_bd_net [get_bd_pins Lateral/lat_dir_out] [get_bd_ports lat_dir_out] [get_bd_pins lat_dac_signal/i_sign] [get_bd_ports led_2]
connect_bd_net [get_bd_ports adc_dat_a_i] \
  [get_bd_pins direct_adc/gpio_io_i] [get_bd_pins CrudePHA_0/raw_adc_data] [get_bd_pins DACSelect_0/signal_2] \
  [get_bd_pins DirectThresholder_1/raw_adc_data] [get_bd_pins Pulse_Storage_1/raw_signal]
connect_bd_net [get_bd_ports adc_dat_b_i] \
  [get_bd_pins direct_adc/gpio2_io_i] [get_bd_pins DACSelect_0/signal_3] [get_bd_pins DirectThresholder_0/raw_adc_data] \
  [get_bd_pins Pulse_Storage_0/raw_signal]
connect_bd_net [get_bd_pins clk_wiz_0/clk_out1] [get_bd_pins DACSelect_0/ddr_clk]
connect_bd_net [get_bd_pins clk_wiz_0/locked] [get_bd_pins DACSelect_0/locked]
connect_bd_net -net axi_gpio_0_gpio_io_o [get_bd_pins ch1_threshold_settings/gpio_io_o] \
  [get_bd_pins CrudePHA_0/l_threshold] [get_bd_pins DACSelect_0/signal_0] [get_bd_pins DirectThresholder_1/l_threshold]
connect_bd_net -net axi_gpio_0_gpio2_io_o [get_bd_pins ch1_threshold_settings/gpio2_io_o] \
  [get_bd_pins DACSelect_0/signal_1] [get_bd_pins DirectThresholder_1/u_threshold]
connect_bd_net [get_bd_pins ch2_threshold_settings/gpio_io_o] [get_bd_pins DACSelect_0/signal_6] [get_bd_pins DirectThresholder_0/l_threshold]
connect_bd_net [get_bd_pins ch2_threshold_settings/gpio2_io_o] [get_bd_pins DACSelect_0/signal_7] [get_bd_pins DirectThresholder_0/u_threshold]
connect_bd_net -net axi_gpio_0_gpio_io_o1 [get_bd_pins threshold_invert_settings/gpio_io_o] \
  [get_bd_pins CrudePHA_0/invert] [get_bd_pins DirectThresholder_1/invert]
connect_bd_net -net axi_gpio_0_gpio2_io_o1 [get_bd_pins threshold_invert_settings/gpio2_io_o] [get_bd_pins DirectThresholder_0/invert]
connect_bd_net -net Ch2_Thresholder_l_threshold_met [get_bd_pins DirectThresholder_0/l_threshold_met] \
  [get_bd_pins xlconcat_0/In4] [get_bd_pins Coincidence_Block/ch2l] [get_bd_pins PulseExtender_0/pulse_in] \
  [get_bd_pins Pulse_Storage_0/lthresh]
connect_bd_net -net Ch2_Thresholder_u_threshold_met [get_bd_pins DirectThresholder_0/u_threshold_met] \
  [get_bd_pins xlconcat_0/In5] [get_bd_pins Coincidence_Block/ch2h] [get_bd_pins Pulse_Storage_0/uthresh]
connect_bd_net [get_bd_pins InputParse_0/adc_data_out] [get_bd_pins sensor_readout/gpio_io_i]
connect_bd_net [get_bd_pins InputParse_0/sensor_data_out] [get_bd_pins sensor_readout/gpio2_io_i]
connect_bd_net [get_bd_pins xlconcat_0/dout] [get_bd_pins thresholded_data/gpio_io_i]
connect_bd_net [get_bd_pins DirectThresholder_1/l_threshold_met] \
  [get_bd_pins xlconcat_0/In0] [get_bd_pins Coincidence_Block/ch1l] [get_bd_pins PulseExtender_1/pulse_in] \
  [get_bd_pins Pulse_Storage_1/lthresh]
connect_bd_net [get_bd_pins DirectThresholder_1/u_threshold_met] \
  [get_bd_pins xlconcat_0/In1] [get_bd_pins Coincidence_Block/ch1h] [get_bd_pins Pulse_Storage_1/uthresh]
connect_bd_net [get_bd_pins DirectThresholder_1/sign] [get_bd_pins xlconcat_0/In2]
connect_bd_net [get_bd_pins DirectThresholder_1/invert_status] [get_bd_pins xlconcat_0/In3]
connect_bd_net [get_bd_pins ch1_offset_settings/gpio_io_o] [get_bd_pins DirectThresholder_1/offset] [get_bd_pins Pulse_Storage_1/offset]
connect_bd_net [get_bd_pins ch1_offset_settings/gpio2_io_o] [get_bd_pins DirectThresholder_1/offset_sign] [get_bd_pins Pulse_Storage_1/offset_sign]
connect_bd_net [get_bd_pins DirectThresholder_0/sign] [get_bd_pins xlconcat_0/In6]
connect_bd_net [get_bd_pins DirectThresholder_0/invert_status] [get_bd_pins xlconcat_0/In7]
connect_bd_net [get_bd_pins ch2_offset_settings/gpio_io_o] [get_bd_pins DirectThresholder_0/offset] [get_bd_pins Pulse_Storage_0/offset]
connect_bd_net [get_bd_pins ch2_offset_settings/gpio2_io_o] [get_bd_pins DirectThresholder_0/offset_sign] [get_bd_pins Pulse_Storage_0/offset_sign]
connect_bd_net [get_bd_pins DACSelect_0/dac_clk] [get_bd_ports dac_clk_o]
connect_bd_net [get_bd_pins DACSelect_0/dac_rst] [get_bd_ports dac_rst_o]
connect_bd_net [get_bd_pins DACSelect_0/dac_sel] [get_bd_ports dac_sel_o]
connect_bd_net [get_bd_pins DACSelect_0/dac_wrt] [get_bd_ports dac_wrt_o]
connect_bd_net [get_bd_pins DACSelect_0/dac_dat] [get_bd_ports dac_dat_o]
connect_bd_net -net axi_gpio_0_gpio_io_o2 [get_bd_pins dac_select/gpio_io_o] [get_bd_pins DACSelect_0/select_a]
connect_bd_net -net axi_gpio_0_gpio2_io_o2 [get_bd_pins dac_select/gpio2_io_o] [get_bd_pins DACSelect_0/select_b]
connect_bd_net [get_bd_pins lat_dac_signal/o_signal] [get_bd_pins DACSelect_0/signal_4]
connect_bd_net [get_bd_pins rot_dac_signal/o_signal] [get_bd_pins DACSelect_0/signal_5]
connect_bd_net [get_bd_pins Rotation/debounced] [get_bd_pins InputParse_0/rot_sense]
connect_bd_net [get_bd_pins Lateral/debounced1] [get_bd_pins InputParse_0/lat_max]
connect_bd_net [get_bd_pins CrudePHA_0/pulse_height] [get_bd_pins fifo_generator_0/din]
connect_bd_net [get_bd_pins CrudePHA_0/ph_valid] [get_bd_pins fifo_generator_0/wr_en]
connect_bd_net [get_bd_pins fifo_generator_0/data_count] [get_bd_pins PHA_Pulses_Stored/gpio_io_i]
connect_bd_net [get_bd_pins fifo_generator_0/almost_full] [get_bd_pins CrudePHA_0/fifo_full]
connect_bd_net [get_bd_pins toggle_test/gpio_io_o] [get_bd_pins FIFOReadout_0/read_request]
connect_bd_net [get_bd_pins FIFOReadout_0/write_done] [get_bd_pins toggle_test/gpio2_io_i]
connect_bd_net [get_bd_pins FIFOReadout_0/FIFO_buffer] [get_bd_pins PHA_Readout/gpio_io_i]
connect_bd_net [get_bd_pins fifo_generator_0/dout] [get_bd_pins FIFOReadout_0/FIFO_data]
connect_bd_net [get_bd_pins FIFOReadout_0/FIFO_read] [get_bd_pins fifo_generator_0/rd_en]
connect_bd_net [get_bd_pins fifo_generator_0/empty] [get_bd_pins FIFOReadout_0/FIFO_empty]
connect_bd_net [get_bd_pins CrudePHA_0/o_state] [get_bd_pins PHA_Readout/gpio2_io_i]
connect_bd_net [get_bd_pins PulseExtender_0/extend_out] [get_bd_pins DACSelect_0/signal_8]
connect_bd_net [get_bd_pins PulseExtender_1/extend_out] [get_bd_pins DACSelect_0/signal_9]
connect_bd_net [get_bd_pins Pulse_Storage_0/parsed_signal] [get_bd_pins DACSelect_0/signal_10]
connect_bd_net [get_bd_pins Pulse_Storage_1/parsed_signal] [get_bd_pins DACSelect_0/signal_11]
connect_bd_net [get_bd_pins Lateral/led3] [get_bd_ports led3]
connect_bd_net [get_bd_pins Lateral/led4] [get_bd_ports led4]
connect_bd_net [get_bd_pins Lateral/debounced] [get_bd_pins InputParse_0/lat_zero]
set_property HDL_ATTRIBUTE.BMM_INFO_PROCESSOR {arm > system axi_bram_ctrl_0} [get_bd_cells processing_system7_0]
set_property HDL_ATTRIBUTE.KEEP_HIERARCHY yes [get_bd_cells processing_system7_0]

# ---- address map ----
assign_bd_address -offset 0x41200000 -range 64K -target_address_space [get_bd_addr_spaces processing_system7_0/Data] [get_bd_addr_segs Rotation/axi_gpio_0/S_AXI/Reg]
assign_bd_address -offset 0x41210000 -range 64K -target_address_space [get_bd_addr_spaces processing_system7_0/Data] [get_bd_addr_segs Lateral/axi_gpio_0/S_AXI/Reg]
assign_bd_address -offset 0x41220000 -range 64K -target_address_space [get_bd_addr_spaces processing_system7_0/Data] [get_bd_addr_segs threshold_invert_settings/S_AXI/Reg]
assign_bd_address -offset 0x41230000 -range 64K -target_address_space [get_bd_addr_spaces processing_system7_0/Data] [get_bd_addr_segs ch1_threshold_settings/S_AXI/Reg]
assign_bd_address -offset 0x41240000 -range 64K -target_address_space [get_bd_addr_spaces processing_system7_0/Data] [get_bd_addr_segs ch2_threshold_settings/S_AXI/Reg]
assign_bd_address -offset 0x41250000 -range 64K -target_address_space [get_bd_addr_spaces processing_system7_0/Data] [get_bd_addr_segs Coincidence_Block/coincidence_settings/S_AXI/Reg]
assign_bd_address -offset 0x41260000 -range 64K -target_address_space [get_bd_addr_spaces processing_system7_0/Data] [get_bd_addr_segs Coincidence_Block/coinc_timeout_counts/S_AXI/Reg]
assign_bd_address -offset 0x41270000 -range 64K -target_address_space [get_bd_addr_spaces processing_system7_0/Data] [get_bd_addr_segs Coincidence_Block/ch1_ch2_counts/S_AXI/Reg]
assign_bd_address -offset 0x41280000 -range 64K -target_address_space [get_bd_addr_spaces processing_system7_0/Data] [get_bd_addr_segs Coincidence_Block/ch1over_ch2over_counts/S_AXI/Reg]
assign_bd_address -offset 0x41290000 -range 64K -target_address_space [get_bd_addr_spaces processing_system7_0/Data] [get_bd_addr_segs Coincidence_Block/coinc_state_timer/S_AXI/Reg]
assign_bd_address -offset 0x412A0000 -range 64K -target_address_space [get_bd_addr_spaces processing_system7_0/Data] [get_bd_addr_segs sensor_readout/S_AXI/Reg]
assign_bd_address -offset 0x412B0000 -range 64K -target_address_space [get_bd_addr_spaces processing_system7_0/Data] [get_bd_addr_segs thresholded_data/S_AXI/Reg]
assign_bd_address -offset 0x412C0000 -range 64K -target_address_space [get_bd_addr_spaces processing_system7_0/Data] [get_bd_addr_segs ch2_offset_settings/S_AXI/Reg]
assign_bd_address -offset 0x412D0000 -range 64K -target_address_space [get_bd_addr_spaces processing_system7_0/Data] [get_bd_addr_segs direct_adc/S_AXI/Reg]
assign_bd_address -offset 0x412E0000 -range 64K -target_address_space [get_bd_addr_spaces processing_system7_0/Data] [get_bd_addr_segs dac_select/S_AXI/Reg]
assign_bd_address -offset 0x412F0000 -range 64K -target_address_space [get_bd_addr_spaces processing_system7_0/Data] [get_bd_addr_segs Rotation/rotation_status/S_AXI/Reg]
assign_bd_address -offset 0x41300000 -range 64K -target_address_space [get_bd_addr_spaces processing_system7_0/Data] [get_bd_addr_segs Lateral/axi_gpio_1/S_AXI/Reg]
assign_bd_address -offset 0x41310000 -range 64K -target_address_space [get_bd_addr_spaces processing_system7_0/Data] [get_bd_addr_segs PHA_Readout/S_AXI/Reg]
assign_bd_address -offset 0x41320000 -range 64K -target_address_space [get_bd_addr_spaces processing_system7_0/Data] [get_bd_addr_segs PHA_Pulses_Stored/S_AXI/Reg]
assign_bd_address -offset 0x41330000 -range 64K -target_address_space [get_bd_addr_spaces processing_system7_0/Data] [get_bd_addr_segs toggle_test/S_AXI/Reg]
assign_bd_address -offset 0x41340000 -range 64K -target_address_space [get_bd_addr_spaces processing_system7_0/Data] [get_bd_addr_segs Coincidence_Block/coincidence_runtime/S_AXI/Reg]
assign_bd_address -offset 0x42220000 -range 64K -target_address_space [get_bd_addr_spaces processing_system7_0/Data] [get_bd_addr_segs ch1_offset_settings/S_AXI/Reg]

validate_bd_design
save_bd_design
